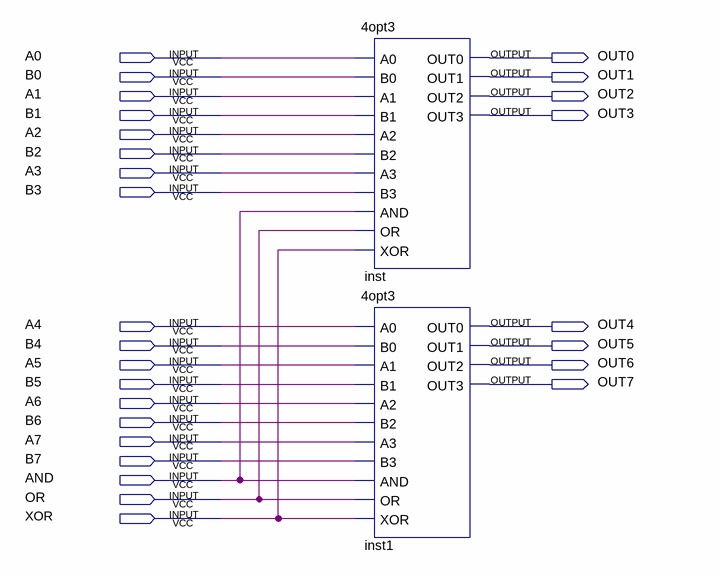
[diagram p0: schematic sheet]
// Quartus schematic 8opt3.bdf as structural Verilog: 2 symbols, 27 pins
module \8opt3  (
  input  A0,
  input  B0,
  input  A1,
  input  B1,
  input  A2,
  input  B2,
  input  A3,
  input  B3,
  input  A4,
  input  B4,
  input  A5,
  input  B5,
  input  A6,
  input  B6,
  input  A7,
  input  B7,
  input  AND,
  input  OR,
  input  XOR,
  output OUT0,
  output OUT1,
  output OUT2,
  output OUT3,
  output OUT4,
  output OUT5,
  output OUT6,
  output OUT7
);

  \4opt3  inst (
    .A0(A0), .B0(B0), .A1(A1), .B1(B1), .A2(A2), .B2(B2), .A3(A3), .B3(B3), .AND(AND), .OR(OR), .XOR(XOR),
    .OUT0(OUT0), .OUT1(OUT1), .OUT2(OUT2), .OUT3(OUT3));
  \4opt3  inst1 (
    .A0(A4), .B0(B4), .A1(A5), .B1(B5), .A2(A6), .B2(B6), .A3(A7), .B3(B7), .AND(AND), .OR(OR), .XOR(XOR),
    .OUT0(OUT4), .OUT1(OUT5), .OUT2(OUT6), .OUT3(OUT7));
endmodule
